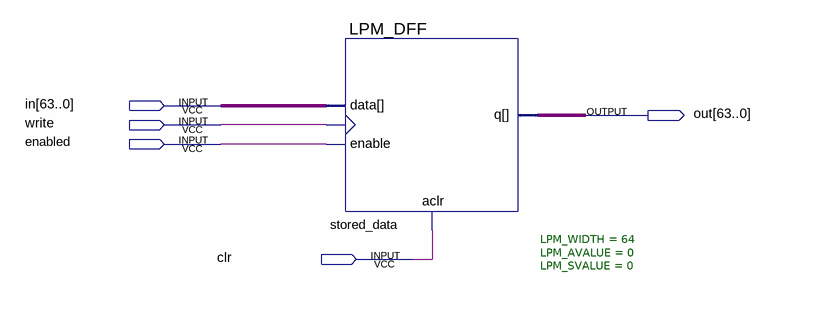
[diagram p0: schematic sheet]
// Quartus schematic in_out_register_64.bdf as structural Verilog: 1 symbols, 5 pins
module in_out_register_64 (
  input  [63:0] in,
  input  write,
  input  enabled,
  input  clr,
  output [63:0] out
);

  LPM_DFF #(.LPM_WIDTH(64), .LPM_AVALUE(0), .LPM_SVALUE(0)) stored_data (
    .enable(enabled), .clock(write), .data(in), .aclr(clr), .q(out));
endmodule
